# Altium project OpenMPPT2.PrjPcb
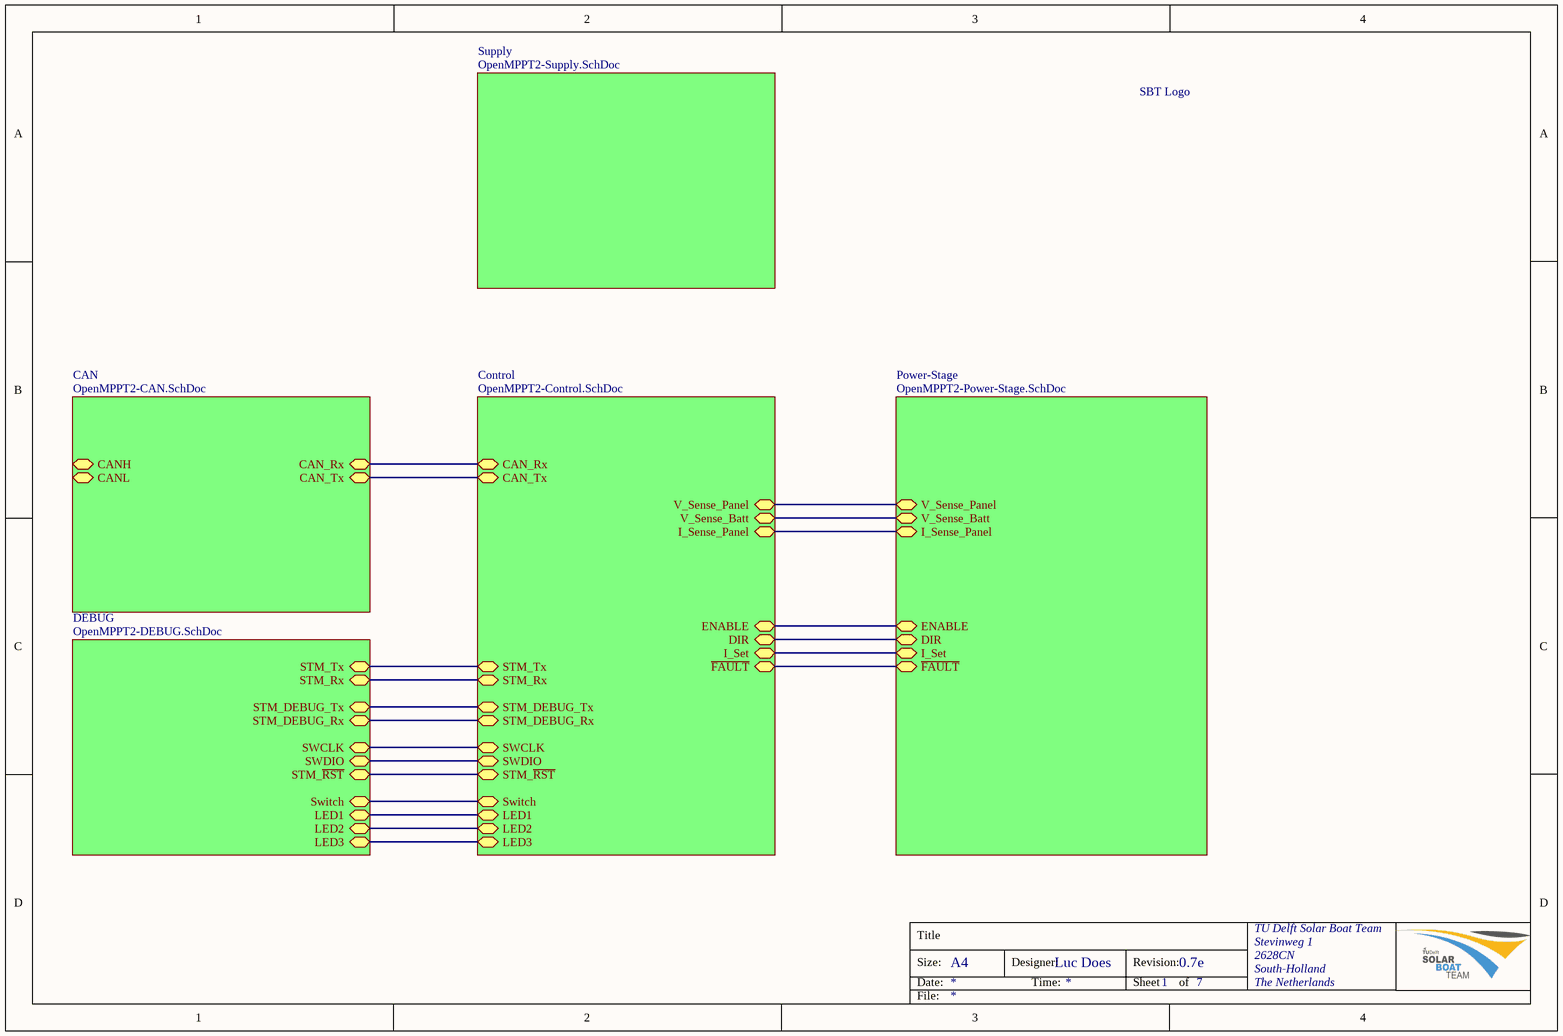
[diagram p0: Top-level.SchDoc]
adres: Stevinweg 1; Designer: Luc Does; land: The Netherlands; organisatie: TU Delft Solar Boat Team; postcode: 2628CN; Project: OpenMPPT; provincie: South-Holland; revisie: 0.7e; sheetTotaal: 7
6 sheets, 110 parts. Net scope: hierarchical (ports join the sheet entries above them; power ports are global).
Board file: OpenMPPT2.PcbDoc
Sheets:
  Top-level.SchDoc
    Control = OpenMPPT2-Control.SchDoc
    Supply = OpenMPPT2-Supply.SchDoc
    Power-Stage = OpenMPPT2-Power-Stage.SchDoc
    DEBUG = OpenMPPT2-DEBUG.SchDoc
    CAN = OpenMPPT2-CAN.SchDoc

## Sheet Top-level.SchDoc: =Project + Document
size A4; SheetNumber: 1; SheetTotal: SheetTotaal; Document: Top-level

### Parts
Logo1  SBT Logo  [SBT Logo 1000x]  (value not drawn)

### Sub-sheets
CAN = OpenMPPT2-CAN.SchDoc: CAN_Rx, CAN_Tx, CANH, CANL
Control = OpenMPPT2-Control.SchDoc: STM_~{RST}, SWCLK, SWDIO, STM_Rx, STM_Tx, STM_DEBUG_Rx, STM_DEBUG_Tx, CAN_Rx, CAN_Tx, LED1, LED2, Switch, V_Sense_Panel, I_Set, V_Sense_Batt, I_Sense_Panel, ENABLE, DIR, ~{FAULT}, LED3
DEBUG = OpenMPPT2-DEBUG.SchDoc: STM_~{RST}, SWCLK, SWDIO, STM_Rx, STM_Tx, STM_DEBUG_Tx, STM_DEBUG_Rx, LED1, LED2, Switch, LED3
Power-Stage = OpenMPPT2-Power-Stage.SchDoc: V_Sense_Panel, I_Set, V_Sense_Batt, I_Sense_Panel, ENABLE, DIR, ~{FAULT}
Supply = OpenMPPT2-Supply.SchDoc: no entries

### Nets
DEBUG_Rx: sheet Control/STM_DEBUG_Rx, sheet DEBUG/STM_DEBUG_Rx
DEBUG_Tx: sheet Control/STM_DEBUG_Tx, sheet DEBUG/STM_DEBUG_Tx
DIR: sheet Control/DIR, sheet Power-Stage/DIR
ENABLE: sheet Control/ENABLE, sheet Power-Stage/ENABLE
~{FAULT}: sheet Control/~{FAULT}, sheet Power-Stage/~{FAULT}
I_Sense_Panel: sheet Control/I_Sense_Panel, sheet Power-Stage/I_Sense_Panel
STM_~{RST}: sheet Control/STM_~{RST}, sheet DEBUG/STM_~{RST}
SWCLK: sheet Control/SWCLK, sheet DEBUG/SWCLK
SWDIO: sheet Control/SWDIO, sheet DEBUG/SWDIO
V_Sense_Batt: sheet Control/V_Sense_Batt, sheet Power-Stage/V_Sense_Batt
V_Sense_Panel: sheet Control/V_Sense_Panel, sheet Power-Stage/V_Sense_Panel
NetC503_2: sheet Control/Switch, sheet DEBUG/Switch
NetIC300_2: sheet Control/CAN_Rx, sheet CAN/CAN_Rx
NetIC300_3: sheet Control/CAN_Tx, sheet CAN/CAN_Tx
NetIC500_2: sheet Control/STM_Rx, sheet DEBUG/STM_Rx
NetIC500_3: sheet Control/STM_Tx, sheet DEBUG/STM_Tx
NetR402_1: sheet Control/I_Set, sheet Power-Stage/I_Set
NetR501_1: sheet Control/LED1, sheet DEBUG/LED1
NetR502_1: sheet Control/LED2, sheet DEBUG/LED2
NetR503_1: sheet Control/LED3, sheet DEBUG/LED3

### Notes on the sheet
- Title
- Size:
- Date:
- A4
- Designer:
- Time:
- Revision:
- Sheet
- of
- File:

### Library data of the parts
Logo1 = SBT Logo: B'vo

## Sheet OpenMPPT2-Control.SchDoc: =Project + Document
size A4; SheetNumber: 3; SheetTotal: SheetTotaal; Document: Control
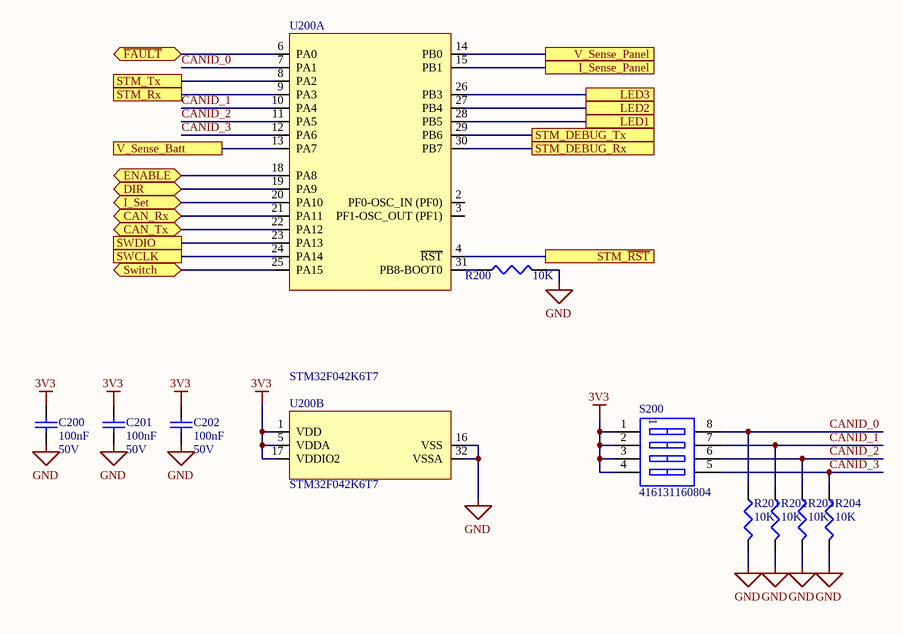
[diagram p1: OpenMPPT2-Control.SchDoc]

### Parts
C200  100nF  Voltage Rating: 50V  [C0603]
C201  100nF  Voltage Rating: 50V  [C0603]
C202  100nF  Voltage Rating: 50V  [C0603]
R200  10K  [0603]
R201  10K  [0603]
R202  10K  [0603]
R203  10K  [0603]
R204  10K  [0603]
S200  416131160804  [416131160804]
U200  STM32F042K6T7  [LQFP32]  (parts A,B of 2)

### Ports
CAN_Rx, CAN_Tx, DIR, ENABLE, I_Sense_Panel, I_Set, LED1, LED2, LED3, STM_DEBUG_Rx, STM_DEBUG_Tx, STM_Rx, STM_Tx, STM_~{RST}, SWCLK, SWDIO, Switch, V_Sense_Batt, V_Sense_Panel, ~{FAULT}

### Nets
3V3: C200.2 C201.2 C202.2 S200.1 S200.2 S200.3 S200.4 U200.1(VDD) U200.5(VDDA) U200.17(VDDIO2)
GND: C200.1 C201.1 C202.1 R200.2 R201.2 R202.2 R203.2 R204.2 U200.16(VSS) U200.32(VSSA)
CANID_0: R201.1 S200.8 U200.7(PA1)
CANID_1: R202.1 S200.7 U200.10(PA4)
CANID_2: R203.1 S200.6 U200.11(PA5)
CANID_3: R204.1 S200.5 U200.12(PA6)
DEBUG_Rx: U200.30(PB7) ; port STM_DEBUG_Rx
DEBUG_Tx: U200.29(PB6) ; port STM_DEBUG_Tx
DIR: U200.19(PA9) ; port DIR
ENABLE: U200.18(PA8) ; port ENABLE
~{FAULT}: U200.6(PA0) ; port ~{FAULT}
I_Sense_Panel: U200.15(PB1) ; port I_Sense_Panel
STM_~{RST}: U200.4(~{RST}) ; port STM_~{RST}
SWCLK: U200.24(PA14) ; port SWCLK
SWDIO: U200.23(PA13) ; port SWDIO
V_Sense_Batt: U200.13(PA7) ; port V_Sense_Batt
V_Sense_Panel: U200.14(PB0) ; port V_Sense_Panel
NetC503_2: U200.25(PA15) ; port Switch
NetIC300_2: U200.21(PA11) ; port CAN_Rx
NetIC300_3: U200.22(PA12) ; port CAN_Tx
NetIC500_2: U200.9(PA3) ; port STM_Rx
NetIC500_3: U200.8(PA2) ; port STM_Tx
NetR200_1: R200.1 U200.31(PB8-BOOT0)
NetR402_1: U200.20(PA10) ; port I_Set
NetR501_1: U200.28(PB5) ; port LED1
NetR502_1: U200.27(PB4) ; port LED2
NetR503_1: U200.26(PB3) ; port LED3

Not connected (* = marked no-connect by the designer): U200 2(PF0-OSC_IN_(PF0)) 3(PF1-OSC_OUT_(PF1))

### Notes on the sheet
- Title
- Size:
- Date:
- A4
- Designer:
- Time:
- Revision:
- Sheet
- of
- File:

### Library data of the parts
C200-C202 = 100nF/0603/CER/50V: Capacitor, 100nF, 50V, X7R; Capacitance Tolerance: ± 10%; Capacitor Case Style: 0603; Brand Number: MCCA000255; Brand: MULTICOMP; Dielectric Characteristic: X7R; Capacitance: 100nF; Temperature Range: -55°C to +125°C; Price: 0,008; Order Code Supplier: 1759122RL; Supplier: Farnell
R200-R204 = 10K/0603/0063W/50V: Resistor, 10K, 1%, 0.063W, 50V, 100PPM, 0603; Brand: MULTICOMP; Brand Number: MC0063W0603110K; Case Style: 0603; Order Code Supplier: 1469748; Power Rating: 0.063W; Price: 0,038; Resistance: 10K; Supplier: Farnell; Temperature Coefficient: ± 100PPM; Temperature Range: -55°C to +125°C; Voltage Rating: 50V
S200 = 416131160804: 1.27 mm small compact SMD flat actuator with top tape WS-DISV; Pole Number: 4; ComponentLink1Description: Manufacturer; ComponentLink1URL: http://www.we-online.de; ComponentLink2Description: Datasheet; ComponentLink2URL: http://katalog.we-online.de/em/datasheet/4161311608xx.pdf; Part Number: 416131160804; Published Date: March 2017; Publisher: Wurth Elektronik
U200 = STM32F042K6T7: 32 Bit Microcontroller, USB Line, ARM Cortex-M0, 48 MHz, 128 KB, 16 KB, 48, LQFP; Brand: STMICROELECTRONICS; Order Code Supplier: 2469553; Supplier: Farnell; Brand Number: STM32F042K6T7; Price: 1.46

## Sheet OpenMPPT2-Supply.SchDoc: =Project + Document
size A4; SheetNumber: 2; SheetTotal: 7; Document: Supply
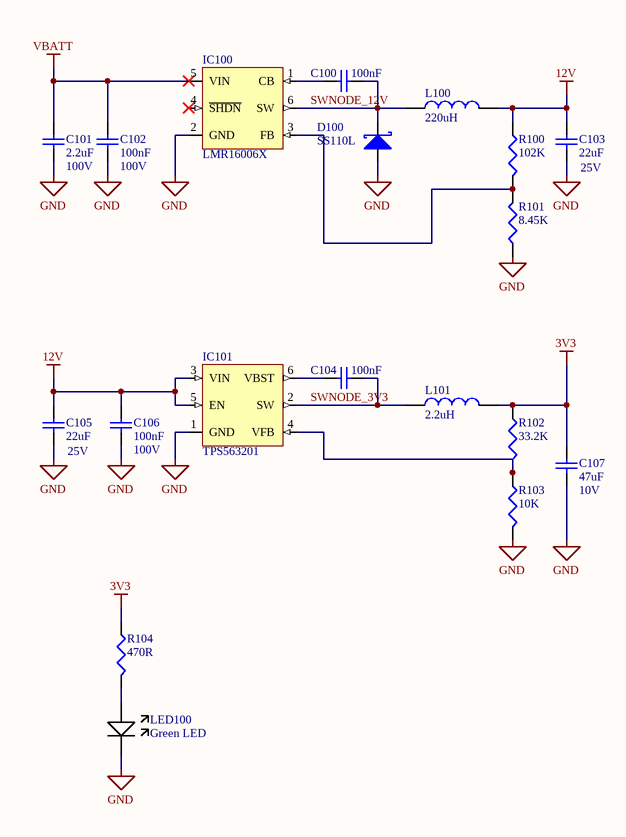
[diagram p2: OpenMPPT2-Supply.SchDoc]

### Parts
C100  100nF  [C-0805]
C101  2.2uF  Voltage Rating: 100V  [C-1210]
C102  100nF  Voltage Rating: 100V  [C-0805]
C103  22uF  Voltage Range: 25V  [C-1206]
C104  100nF  [C-0805]
C105  22uF  Voltage Range: 25V  [C-1206]
C106  100nF  Voltage Rating: 100V  [C-0805]
C107  47uF  Voltage Rating: 10V  [C-1210]
D100  SS110L  [SUB-SMA]
IC100  LMR16006X  [SOT-23-6]
IC101  TPS563201  [SOT-23-6]
L100  value 220uH  [WE-PD_1050_Metal Base]  (hidden comment: WE-PD, 7447714221)
L101  value 2.2uH  [WE-PD_7332_Metal Base]  (hidden comment: WE-PD, 744778002)
LED100  Green LED  [0603]
R100  102K  [0603]
R101  8.45K  [0603]
R102  33.2K  [0603]
R103  10K  [0603]
R104  470R  [0603]

### Nets
3V3: C107.1 L101.2 R102.1 R104.1
12V: C103.1 C105.1 C106.2 IC101.3(VIN) IC101.5(EN) L100.2 R100.1
GND: C101.1 C102.1 C103.2 C105.2 C106.1 C107.2 D100.1(A) IC100.2(GND) IC101.1(GND) LED100.K R101.1 R103.2
VBATT: C101.2 C102.2 IC100.5(VIN)
SWNODE_3V3: C104.2 IC101.2(SW) L101.1
SWNODE_12V: C100.2 D100.2(K) IC100.6(SW) L100.1
NetC100_1: C100.1 IC100.1(CB)
NetC104_1: C104.1 IC101.6(VBST)
NetIC100_3: IC100.3(FB) R100.2 R101.2
NetIC101_4: IC101.4(VFB) R102.2 R103.1
NetLED100_A: LED100.A R104.2

Not connected (* = marked no-connect by the designer): IC100 4(~{SHDN})*

### Notes on the sheet
- Title
- Size:
- Date:
- A4
- Designer:
- Time:
- Revision:
- Sheet
- of
- File:

### Library data of the parts
C100 C102 C104 C106 = 100nF/0805/CER/100V: Capacitor, 100nF, 100V, X7R; Capacitance Tolerance: ± 10%; Capacitor Case Style: 0805; Brand Number: C0805C104K1RACTU; Brand: KEMET; Dielectric Characteristic: X7R; Capacitance: 100nF; Temperature Range: -55°C to +125°C; Price: 0,096; Order Code Supplier: 1650862; Supplier: Farnell
  C100 C104: Voltage Rating: 100V
C101 = 2.2uF/1210/CER/100V: Capacitor, 2.2uF, 100V, X7R; Capacitance Tolerance: ± 20%; Capacitor Case Style: 1210; Brand Number: C1210C225M1RACTU; Brand: KEMET; Dielectric Characteristic: X7R; Capacitance: 2.2uF; Temperature Range: -55°C to +125°C; Price: 0,64; Order Code Supplier: 1838747; Supplier: Farnell
C103 C105 = 22uF/1206/CER/25V: Capacitor, 22uF, 25V, ±10%, X5R, C1206, T:-55°C to +85°C; Brand: Murata; Brand Number: GRM31CR61E226KE15L; Capacitor Case Style: 1206; Order Code Supplier: 1797010; Price: 0,64; Dielectric Characteristic: X5R; Capacitance: 22uF; Capacitance Tolerance: ± 10%; Supplier: Farnell; Temperature Range: -55°C to +85°C
C107 = 47uF/1210/CER/10V: Capacitor, 47uF, 10V, X7R; Capacitance Tolerance: ± 10%; Capacitor Case Style: 1210; Brand Number: GRM32ER71A476KE15L; Brand: MURATA; Dielectric Characteristic: X7R; Capacitance: 47uF; Temperature Range: -55°C to +125°C; Price: 1,85; Order Code Supplier: 1797018; Supplier: Farnell
D100 = SS110L: Diode Schottky, Vrrm: 100V, If: 1A, Vf: 0.9V; Brand: TAIWAN SEMICONDUCTOR; Case Style: SMF; Brand Number: SS110L; Forward Current: 1A; Forward Voltage: 0.9V; Order Code Supplier: 1559156; Price: 0,191; Supplier: Farnell; Temperature Range: -55°C to +150°C; Vrrm: 100V
IC100 = LMR16006X: 60V, 600mA Step-Down Regulator; Brand: Texas Instruments; Case Style: TSOT-6; Brand Number: LMR16006X; Order Code Supplier: 2455133; Price: 3,37; Supplier: Farnell; Temperature Range: -55°C to +155°C
IC101 = TPS563201: 17V Input, 3-A Synchronous Step-Down Voltage Regulator; Brand: Texas Instruments; Case Style: TSOT; Brand Number: TPS563201; Order Code Supplier: 2522588; Price: 1,44; Supplier: Farnell; Temperature Range: -55°C to +155°C
L100 = WE-PD, 7447714221: WE-PD SMD Shielded Power Inductor, size 1050, 220uH; Base: Metal Base; PublishedDate: Sep. 2016; Publisher: Wurth Elektronik; ComponentLink1Description: Manufacturer; ComponentLink1URL: http://www.we-online.de; ComponentLink2Description: Datasheet; ComponentLink2URL: http://katalog.we-online.com/pbs/datasheet/7447714221.pdf; PartNumber: 7447714221; Size: 1050
L101 = WE-PD, 744778002: WE-PD SMD Shielded Power Inductor, size 7332, 2.2uH; Base: Metal Base; PublishedDate: Sep. 2016; Publisher: Wurth Elektronik; ComponentLink1Description: Manufacturer; ComponentLink1URL: http://www.we-online.de; ComponentLink2Description: Datasheet; ComponentLink2URL: http://katalog.we-online.com/pbs/datasheet/744778002.pdf; PartNumber: 744778002; Size: 7332
LED100 = KPT-1608SGC: LED, Green, 0603; Brand: Kingbright; Forward Voltage: 2.2V; Forward Current: 20mA; Order Code Supplier: 2099223; Supplier: Farnell; Price: 0,057; Brand Number: KPT-1608SGC
R100 = 102K/0603/0100W/75V: Resistor, 102K, 1%, 0.063W, 50V, 100PPM, 0603; Brand: Vishay; Brand Number: CRCW0603102KFKEA.; Power Rating: 0.100W; Voltage Rating: 75V; Case Style: 0603; Order Code Supplier: 2138497; Price: 0,0402; Resistance: 102K; Supplier: Farnell; Temperature Coefficient: ± 100PPM; Temperature Range: -55°C to +125°C
R101 = 8.45K/0603/0100W/75V: Resistor, 8.45K, 1%, 0.1W, 75V, 100PPM, 0603; Brand: Vishay; Brand Number: CRCW06038K45FKEA.; Case Style: 0603; Order Code Supplier: 2138418; Power Rating: 0.1W; Price: 0,0419; Resistance: 8.45K; Supplier: Farnell; Temperature Coefficient: ± 100PPM; Temperature Range: -55°C to +155°C; Voltage Rating: 75V
R102 = 33.2K/0603/0063W/50V: Resistor, 33.2K, 1%, 0.063W, 50V, 100PPM, 0603; Brand: MULTICOMP; Brand Number: MC 0.063W 0603 1% 33K2; Case Style: 0603; Order Code Supplier: 1170939; Power Rating: 0.063W; Price: 0,038; Resistance: 33.2K; Supplier: Farnell; Temperature Coefficient: ± 100PPM; Temperature Range: -55°C to +125°C; Voltage Rating: 50V
R103 = 10K/0603/0063W/50V: as R200 on sheet OpenMPPT2-Control; Case Style: 0603; Order Code Supplier: 2130939; Power Rating: 0.063W; Price: 0,038; Resistance: 10K; Supplier: Farnell; Temperature Coefficient: ± 100PPM; Temperature Range: -55°C to +125°C; Voltage Rating: 50V
R104 = 470/0603/0125W/50V: Resistor, 470R, 1%, 0.125W, 50V, 100PPM, 0603; Brand: MULTICOMP; Brand Number: MCHP03W8F4700T5E; Case Style: 0603; Order Code Supplier: 1576273; Power Rating: 0.125W; Price: 0,08; Resistance: 470R; Supplier: Farnell; Temperature Coefficient: ± 100PPM; Temperature Range: -55°C to +155°C; Voltage Rating: 50V

## Sheet OpenMPPT2-Power-Stage.SchDoc: =Project + Document
size A4; SheetNumber: 5; SheetTotal: SheetTotaal; Document: Power-Stage
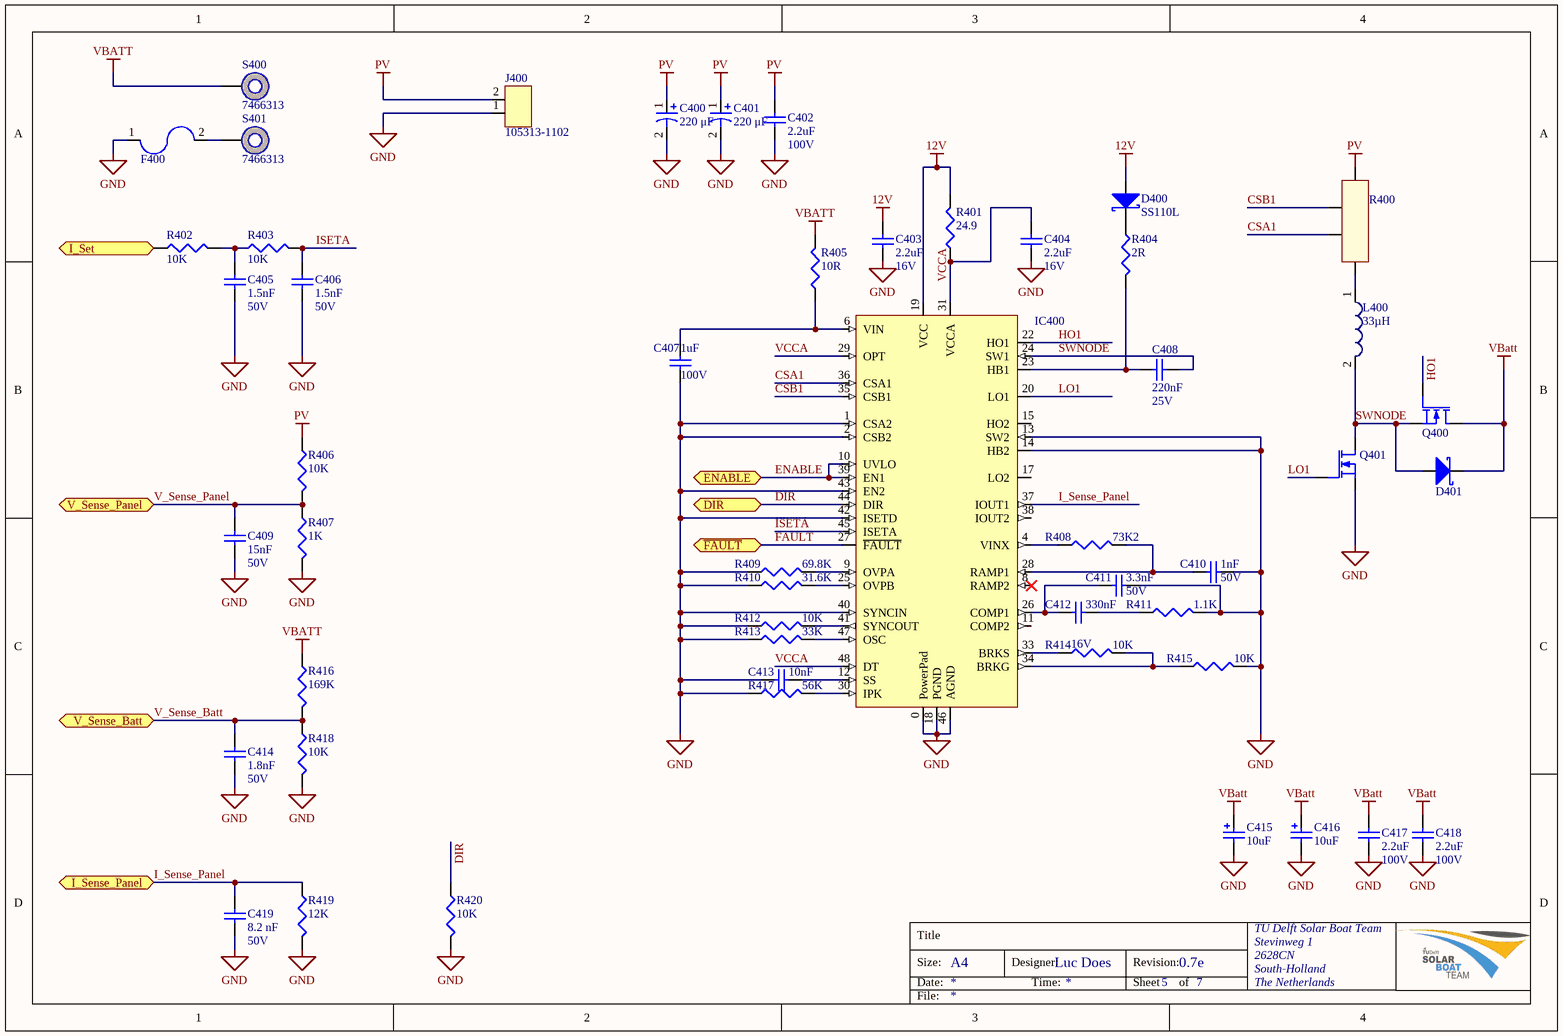
[diagram p3: OpenMPPT2-Power-Stage.SchDoc]

### Parts
C400  220 μF  [WCAP-ATLI 10x16x5x0.6]
C401  220 μF  [WCAP-ATLI 10x16x5x0.6]
C402  2.2uF  Voltage Rating: 100V  [C-1812]
C403  2.2uF  Voltage Rating: 16V  [C-1206]
C404  2.2uF  Voltage Rating: 16V  [C-1206]
C405  1.5nF  Voltage Rating: 50V  [C0603]
C406  1.5nF  Voltage Rating: 50V  [C0603]
C407  1uF  Voltage Rating: 100V  [C-1206]
C408  220nF  Voltage Rating: 25V  [C0603]
C409  15nF  Voltage Rating: 50V  [C0603]
C410  1nF  Voltage Rating: 50V  [C0603]
C411  3.3nF  Voltage Rating: 50V  [C0603]
C412  330nF  Voltage Rating: 16V  [C0603]
C413  10nF  [C0603]
C414  1.8nF  Voltage Rating: 50V  [C0603]
C415  10uF  [WCAP-PTHR_8x11.5x3.5x0.6]
C416  10uF  [WCAP-PTHR_8x11.5x3.5x0.6]
C417  2.2uF  Voltage Rating: 100V  [C-1812]
C418  2.2uF  Voltage Rating: 100V  [C-1812]
C419  8.2 nF  Voltage Rating: 50V  [C0603]
D400  SS110L  [SUB-SMA]
D401  SDT5H100P5-7  [PowerDI5]  (value not drawn)
F400  0154010.DR  [0154010.DR]  (value not drawn)
IC400  LM5170  [TQFP48 - PowerPad]  (value not drawn)
J400  105313-1102  [Nano-Fit 2p RA]
L400  33µH  [WE-HCF 2818]
Q400  PSMN010-80YL  [SOT-669]  (value not drawn)
Q401  PSMN010-80YL  [SOT-669]  (value not drawn)
R400  WSK06125L000FEA  [WSK0612]  (value not drawn)
R401  24.9  [0603]
R402  10K  [0603]
R403  10K  [0603]
R404  2R  [0603]
R405  10R  [0603]
R406  10K  [0603]
R407  1K  [0603]
R408  73K2  [0603]
R409  69.8K  [0603]
R410  31.6K  [0603]
R411  1.1K  [0603]
R412  10K  [0603]
R413  33K  [0603]
R414  10K  [0603]
R415  10K  [0603]
R416  169K  [0603]
R417  56K  [0603]
R418  10K  [0603]
R419  12K  [0603]
R420  10K  [0603]
S400  7466313  [7466313-2]
S401  7466313  [7466313-2]

### Ports
DIR, ENABLE, I_Sense_Panel, I_Set, V_Sense_Batt, V_Sense_Panel, ~{FAULT}

### Nets
12V: C403.2 D400.1(A) IC400.19(VCC) R401.2
GND: C400.2 C401.2 C402.2 C403.1 C404.1 C405.1 C406.1 C407.1 C409.2 C410.2 C411.2 C413.1 C414.2 C415.2(N) C416.2(N) C417.2 C418.2 C419.1 F400.1 IC400.0(PowerPad) IC400.1(CSA2) IC400.2(CSB2) IC400.13(SW2) IC400.14(HB2) IC400.18(PGND) IC400.40(SYNCIN) IC400.42(ISETD) IC400.43(EN2) IC400.46(AGND) J400.1 Q401.S R407.2 R409.1 R410.1 R411.2 R412.1 R413.1 R415.2 R417.1 R418.2 R419.2 R420.2
PV: C400.1 C401.1 C402.1 J400.2 R400.b R406.1
VBATT: C415.1(P) C416.1(P) C417.1 C418.1 D401.K Q400.D R405.2 R416.1 S400.1
CSA1: IC400.36(CSA1) R400.as
CSB1: IC400.35(CSB1) R400.bs
DIR: IC400.44(DIR) R420.1 ; port DIR
ENABLE: IC400.10(UVLO) IC400.39(EN1) ; port ENABLE
~{FAULT}: IC400.27(~{FAULT}) ; port ~{FAULT}
HO1: IC400.22(HO1) Q400.G
I_Sense_Panel: C419.2 IC400.37(IOUT1) R419.1 ; port I_Sense_Panel
ISETA: C406.2 IC400.45(ISETA) R403.2
LO1: IC400.20(LO1) Q401.G
SWNODE: C408.2 D401.A IC400.24(SW1) L400.2 Q400.S Q401.D
V_Sense_Batt: C414.1 R416.2 R418.1 ; port V_Sense_Batt
V_Sense_Panel: C409.1 R406.2 R407.1 ; port V_Sense_Panel
VCCA: C404.2 IC400.29(OPT) IC400.31(VCCA) IC400.48(DT) R401.1
NetC405_2: C405.2 R402.2 R403.1
NetC407_2: C407.2 IC400.6(VIN) R405.1
NetC408_1: C408.1 IC400.23(HB1) R404.2
NetC410_1: C410.1 IC400.28(RAMP1) R408.2
NetC411_1: C411.1 C412.1 IC400.26(COMP1)
NetC412_2: C412.2 R411.1
NetC413_2: C413.2 IC400.12(SS)
NetD400_2: D400.2(K) R404.1
NetF400_2: F400.2 S401.1
NetIC400_4: IC400.4(VINX) R408.1
NetIC400_9: IC400.9(OVPA) R409.2
NetIC400_25: IC400.25(OVPB) R410.2
NetIC400_30: IC400.30(IPK) R417.2
NetIC400_33: IC400.33(BRKS) R414.1
NetIC400_34: IC400.34(BRKG) R414.2 R415.1
NetIC400_41: IC400.41(SYNCOUT) R412.2
NetIC400_47: IC400.47(OSC) R413.2
NetL400_1: L400.1 R400.a
NetR402_1: R402.1 ; port I_Set

Not connected (* = marked no-connect by the designer): IC400 8(RAMP2)* 11(COMP2) 15(HO2) 17(LO2) 38(IOUT2)

### Notes on the sheet
- Title
- Size:
- Date:
- A4
- Designer:
- Time:
- Revision:
- Sheet
- of
- File:

### Library data of the parts
C400 C401 = WCAP-ATLI 10x16x5x0.6 860080675015: WCAP-ATLI Aluminum Electrolytic Capacitors , 220 μF; + / - 20%; 50 V , 10 x 16; Manufacturer: Wurth Elektronik; E-mail: libraries@we-online.com; Characteristics: Aluminum Electrolytic Capacitor;Recommended soldering: Wave;Operating temperature: –55 °C to +105 °C;Low impedance product series;Load life: 2000–5000 h @ +105 °C; ComponentLink1Description: Manufacturer; ComponentLink1URL: http://www.we-online.com; ComponentLink2Description: Datasheet; ComponentLink2URL: http://katalog.we-online.de/pbs/datasheet/860080675015.pdf; Created by: Karrer Zheng; Created Date: 5/13/2015; Capacitance: 220 μF; Application: Applied to high frequency secondary side output filter loop, general switching power supply, DC-DC converter, AC-DC converter, adapter, charger, TV, VCR, DC motor circuit filter, LCD TV digital audio, digital TV, digital camera, digital video camera, satellite receiver and etc.; partNo: 860080675015
C402 C417 C418 = 2.2uF/1812/CER/100V: Capacitor, 2.2uF, 100V, X7R; Capacitance Tolerance: ± 20%; Capacitor Case Style: 1210; Brand Number: C4532X7R2A225M230KA; Brand: TDK; Dielectric Characteristic: X7R; Capacitance: 2.2uF; Temperature Range: -55°C to +125°C; Price: 0.185; Order Code Supplier: 1843176; Supplier: Farnell
C403 C404 = 2.2uF/1206/CER/16V: Capacitor, 2.2uF, 16V, X7R; Capacitance Tolerance: ± 10%; Capacitor Case Style: 1206; Brand Number: C1206C225K4RACTU; Brand: KEMET; Dielectric Characteristic: X7R; Capacitance: 2.2uF; Temperature Range: -55°C to +125°C; Price: 0,28; Order Code Supplier: 9227911; Supplier: Farnell
C405 C406 = 1.5nF/0603/CER/50V: Capacitor, 1.5pF, 50V, C0G/NP0; Capacitance Tolerance: ± 5%; Capacitor Case Style: 0603; Brand Number: GRM1885C1H152JA01D; Brand: MURATA; Dielectric Characteristic: C0G/NP0; Capacitance: 1.5nF; Temperature Range: -55°C to +125°C; Price: 0,0551; Order Code Supplier: 8819939; Supplier: Farnell
C407 = 1uF/1206/CER/100V: Capacitor, 1uF, 100V, X7R; Capacitance Tolerance: ± 10%; Capacitor Case Style: 1206; Brand Number: 12061C105K4Z2A; Brand: AVX; Dielectric Characteristic: X7R; Capacitance: 1uF; Temperature Range: -55°C to +125°C; Price: 0,52; Order Code Supplier: 1833855; Supplier: Farnell
C408 = 220nF/0603/CER/25V: Capacitor, 220nF, 25V, X7R; Capacitance Tolerance: ± 10%; Capacitor Case Style: 0603; Brand Number: 06033C224KAT2A; Brand: AVX; Dielectric Characteristic: X7R; Capacitance: 220nF; Temperature Range: -55°C to +125°C; Price: 0,111; Order Code Supplier: 320795; Supplier: Farnell
C409 = 15nF/0603/CER/50V: Capacitor, 15nF, 50V, X7R; Capacitance Tolerance: ± 10%; Capacitor Case Style: 0603; Brand Number: 0603B153K500CT; Brand: WALSIN; Dielectric Characteristic: X7R; Capacitance: 15nF; Temperature Range: -55°C to +125°C; Price: 0,0169; Order Code Supplier: 2496840; Supplier: Farnell
C410 = 1nF/0603/CER/50V/C0G: Capacitor, 1nF, 50V, C0G; Dielectric Characteristic: C0G/NP0; Capacitance Tolerance: ± 5%; Capacitor Case Style: 0603; Brand Number: GRM1885C1H102JA01D; Brand: MURATA; Capacitance: 1nF; Temperature Range: -55°C to +125°C; Price: 0,0299; Order Code Supplier: 8819920; Supplier: Farnell
C411 = 3.3nF/0603/CER/50V: Capacitor, 3.3nF, 50V, X7R; Capacitance Tolerance: ± 10%; Capacitor Case Style: 0603; Brand Number: 0603B332K500CT; Brand: WALSIN; Dielectric Characteristic: X7R; Capacitance: 3.3nF; Temperature Range: -55°C to +125°C; Price: 0,0118; Order Code Supplier: 2496853; Supplier: Farnell
C412 = 330nF/0603/CER/16V: Capacitor, 330nF, 16V, X7R; Capacitance Tolerance: ± 10%; Capacitor Case Style: 0603; Brand Number: GRM188R71C334KA01D; Brand: MURATA; Dielectric Characteristic: X7R; Capacitance: 330nF; Temperature Range: -55°C to +125°C; Price: 0,052; Order Code Supplier: 1828892; Supplier: Farnell
C413 = 10nF/0603/CER/50V: Capacitor, 10nF, 50V, X7R; Capacitance Tolerance: ± 10%; Capacitor Case Style: 0603; Brand Number: C0603C103K5RACTU; Brand: KEMET; Dielectric Characteristic: X7R; Capacitance: 10nF; Temperature Range: -55°C to +125°C; Price: 0,011; Order Code Supplier: 1414609; Supplier: Farnell
C414 = 1.8nF/0603/CER/50V: Capacitor, 1.8nF, 50V, X7R; Capacitance Tolerance: ± 10%; Capacitor Case Style: 0603; Brand Number: 0603B182K500CT; Brand: WALSIN; Dielectric Characteristic: X7R; Capacitance: 1.8nF; Temperature Range: -55°C to +125°C; Price: 0,015; Order Code Supplier: 2524826; Supplier: Farnell
C415 C416 = WCAP-PTHR, 870055874001: WCAP-PTHR Aluminum Polymer Capacitors, 10uF; RatedVoltage: 63V; PublishedDate: July 2016; Publisher: Wurth Elektronik; ComponentLink1Description: Manufacturer; ComponentLink1URL: http://www.we-online.de; ComponentLink2Description: Datasheet; ComponentLink2URL: http://katalog.we-online.com/pbs/datasheet/870055874001.pdf; PartNumber: 870055874001; Value: 10uF; Size: 8mmx11.5mm
C419 = 8.2nF/0603/CER/50V: Capacitor, 8.2nF, 50V, X7R; Capacitance Tolerance: ± 10%; Capacitor Case Style: 0603; Brand Number: VJ0603Y822KCAAJ; Brand: VISHAY; Dielectric Characteristic: X7R; Capacitance: 8.2 nF; Temperature Range: -55°C to +125°C; Price: 0,163; Order Code Supplier: 2672789; Supplier: Farnell
D400 = SS110L: as D100 on sheet OpenMPPT2-Supply; Brand Number: SS110L; Forward Current: 1A; Forward Voltage: 0.9V; Order Code Supplier: 1559156; Price: 0,191; Supplier: Farnell; Temperature Range: -55°C to +150°C; Vrrm: 100V
D401 = SDT5H100P5-7: Diode Schottky, Vrrm: 100V, If: 5.0A, Vf: 0.62V; Brand: Diodes Incorporated; Brand Number: SDT5H100P5-7; Case Style: PowerDI5; Forward Current: 5.0A; Forward Voltage: 0.62V; Order Code Supplier: 2709573; Price: 0,633; Supplier: Farnell; Temperature Range: -55°C to +150°C; Vrrm: 100V
F400 = 0154010.DR: Miniature SMD Fuse and Holder Assembly, 10A; Supplier: Farnell; Price: 1,53; Order Code Supplier: 2688684; Brand Number: 0154010.DR
IC400 = LM5170: Multiphase Bidirectional Current Controller; Brand: Texas Instruments; Case Style: TQFP-48; Brand Number: LM5170; Supplier: Digi-Key; Order Code Supplier: 296-45255-1-ND; Price: 11,00
J400 = 105313-1102: Molex nano-fit 2 pins connector, single row, right angle; Case Style: 105313; Pitch: 2.5mm; Brand: MOLEX; Brand Number: 105313-1102; Order Code Supplier: 538-105313-1102; Price: 0,672; Supplier: Mouser
L400 = WE-HCF 2818, 7443643300: SMD High Current Inductor WE-HCF, L=33µH; PartNo: 7443643300; Inductance: 33µH; ComponentLink1Description: Manufacturer; ComponentLink1URL: http://www.we-online.de; Created by: Christin Zierenner; Created Date: Oct-2014; ComponentLink2Description: Datasheet; ComponentLink2URL: http://katalog.we-online.de/kataloge/eisos/media/pdf/7443643300.pdf; Supplier: Farnell; Order Code Supplier: 2431617
Q400 Q401 = PSMN010-80YL: Mosfet, N-channel, 80V, 84A, 1.7V, 8.1mohm; Brand: NXP; Gate Source Voltage: 10V; On Resistance: 0.0081ohm; Transistor Polarity: N Channel; Brand Number: PSMN010-80YL; Case Style: SOT-669; Drain Current: 84A; Drain Source Voltage: 80V; Order Code Supplier: 2617065; Price: 0,932; Supplier: Farnell; Temperature Range: -55°C to +150°C; Threshold Voltage: 1.7V
R400 = WSK06125L000FEA: RES, METAL STRIP, 0.005OHM, 1%; Case Style: 0612; Brand: VISHAY; Supplier: Farnell; Price: 0.899; Order Code Supplier: 2420730; Brand Number: WSK06125L000FEA
R401 = 24.9/0603/0100W/75V: Resistor, 24.9R, 1%, 0.1W, 75V, 100PPM, 0603; Brand: VISHAY; Brand Number: CRCW060324R9FKEA.; Case Style: 0603; Order Code Supplier: 2141207; Power Rating: 0.1W; Price: 0,0419; Resistance: 24.9; Supplier: Farnell; Temperature Coefficient: ± 100PPM; Temperature Range: -55°C to +155°C; Voltage Rating: 75V
R402 R403 R406 R412 R414 R415 R418 R420 = 10K/0603/0063W/50V: as R200 on sheet OpenMPPT2-Control; Case Style: 0603; Power Rating: 0.063W; Price: 0,038; Resistance: 10K; Supplier: Farnell; Temperature Coefficient: ± 100PPM; Temperature Range: -55°C to +125°C; Voltage Rating: 50V
  R402 R403 R412 R414 R415: Order Code Supplier: 1469748
  R406 R418 R420: Order Code Supplier: 2130939
R404 = 2/0603/0100W/75V: Resistor, 2R, 5%, 0.1W, 75V, 200PPM, 0603; Brand: PANASONIC; Brand Number: ERJ3GEYJ2R0V; Case Style: 0603; Order Code Supplier: 2059531; Power Rating: 0.1W; Price: 0,009; Resistance: 2R; Supplier: Farnell; Temperature Coefficient: ± 200PPM; Temperature Range: -55°C to +125°C; Voltage Rating: 75V
R405 = 10/0603/0125W/50V: Resistor, 10R, 1%, 0.125W, 50V, 200PPM, 0603; Brand: MULTICOMP; Brand Number: MCHP03W8F100JT5E; Case Style: 0603; Order Code Supplier: 1576250; Power Rating: 0.125W; Price: 0,08; Resistance: 10R; Supplier: Farnell; Temperature Coefficient: ± 200PPM; Temperature Range: -55°C to +155°C; Voltage Rating: 50V
R407 = 1K/0603/0063W/50V: Resistor, 1K, 1%, 0.063W, 50V, 100PPM, 0603; Brand: MULTICOMP; Brand Number: MC0063W060311K; Case Style: 0603; Order Code Supplier: 2130855; Power Rating: 0.063W; Price: 0,039; Resistance: 1K; Supplier: Farnell; Temperature Coefficient: ± 100PPM; Temperature Range: -55°C to +125°C; Voltage Rating: 50V
R408 = 73K2/0603/0063W/50V: Resistor, 73K2, 1%, 0.063W, 50V, 100PPM, 0603; Brand: MULTICOMP; Brand Number: CRCW060373K2FKEA; Case Style: 0603; Order Code Supplier: 2138484; Power Rating: 0.063W; Price: 0,0185; Resistance: 73K2; Supplier: Farnell; Temperature Coefficient: ± 100PPM; Temperature Range: -55°C to +125°C; Voltage Rating: 50V
R409 = 69.8K/0603/0100W/100V: Resistor, 69.8K, 0.1%, 0.1W, 100V, 15PPM, 0603; Brand: TE CONNECTIVITY / HOLSWORTHY; Brand Number: RP73D1J69K8BTDG; Temperature Coefficient: ± 100PPM; Case Style: 0603; Order Code Supplier: 1752678; Power Rating: 0.1W; Price: 1,07; Resistance: 69.8K; Supplier: Farnell; Temperature Range: -55°C to +155°C; Voltage Rating: 100V
R410 = 31.6K/0603/0100W/75V: Resistor, 31.6K, 1%, 0.1W, 75V, 100PPM, 0603; Brand: Vishay; Brand Number: CRCW060331K6FKEA.; Case Style: 0603; Order Code Supplier: 2138454; Power Rating: 0.1W; Price: 0,0419; Resistance: 31.6K; Supplier: Farnell; Temperature Coefficient: ± 100PPM; Temperature Range: -55°C to +155°C; Voltage Rating: 75V
R411 = 1.1K/0603/0100W/75V: Resistor, 1.1K, 1%, 0.1W, 75V, 100PPM, 0603; Brand: Vishay; Brand Number: CRCW06031K10FKEA.; Case Style: 0603; Order Code Supplier: 2138353; Power Rating: 0.1W; Price: 0,00419; Resistance: 1.1K; Supplier: Farnell; Temperature Coefficient: ± 100PPM; Temperature Range: -55°C to +155°C; Voltage Rating: 75V
R413 = 33K/0603/0063W/50V: Resistor, 33K, 1%, 0.063W, 50V, 100PPM, 0603; Brand: MULTICOMP; Brand Number: MC 0.063W 0603 1% 33K; Case Style: 0603; Order Code Supplier: 9331034; Power Rating: 0.063W; Price: 0,038; Resistance: 33K; Supplier: Farnell; Temperature Coefficient: ± 100PPM; Temperature Range: -55°C to +125°C; Voltage Rating: 50V
R416 = 169K/0603/0063W/50V: Resistor, 169K, 1%, 0.063W, 50V, 100PPM, 0603; Brand: MULTICOMP; Brand Number: MC 0.063W 0603 1% 169K; Case Style: 0603; Order Code Supplier: 1171007; Power Rating: 0.063W; Price: 0,017; Resistance: 169K; Supplier: Farnell; Temperature Coefficient: ± 100PPM; Temperature Range: -55°C to +125°C; Voltage Rating: 50V
R417 = 56K/0603/0100W/75V: Resistor, 56K, 1%, 0.1W, 75V, 100PPM, 0603; Brand: MULTICOMP; Brand Number: MCSR06X5602FTL; Case Style: 0603; Order Code Supplier: 2138473; Power Rating: 0.1W; Price: 0,0103; Resistance: 56K; Supplier: Farnell; Temperature Coefficient: ± 100PPM; Temperature Range: -55°C to +155°C; Voltage Rating: 75V
R419 = 12K/0603/0063W/50V: Resistor, 12K, 1%, 0.063W, 50V, 100PPM, 0603; Brand: MULTICOMP; Brand Number: MC0063W0603112K; Case Style: 0603; Order Code Supplier: 2130943; Power Rating: 0.063W; Price: 0,0006; Resistance: 12K; Supplier: Farnell; Temperature Coefficient: ± 1%; Temperature Range: -55°C to +125°C; Voltage Rating: 50V
S400 S401 = 7466313: WP-SMRA SMT Right Angle M3 Thread; PublishedDate: Aug 2016; Publisher: Wurth Elektronik; ComponentLink1Description: Manufacturer; ComponentLink1URL: http://www.we-online.de; ComponentLink2Description: Datasheet; PartNumber: 7466313

## Sheet OpenMPPT2-DEBUG.SchDoc: =Project + Document
size A4; SheetNumber: 7; SheetTotal: SheetTotaal; Document: DEBUG
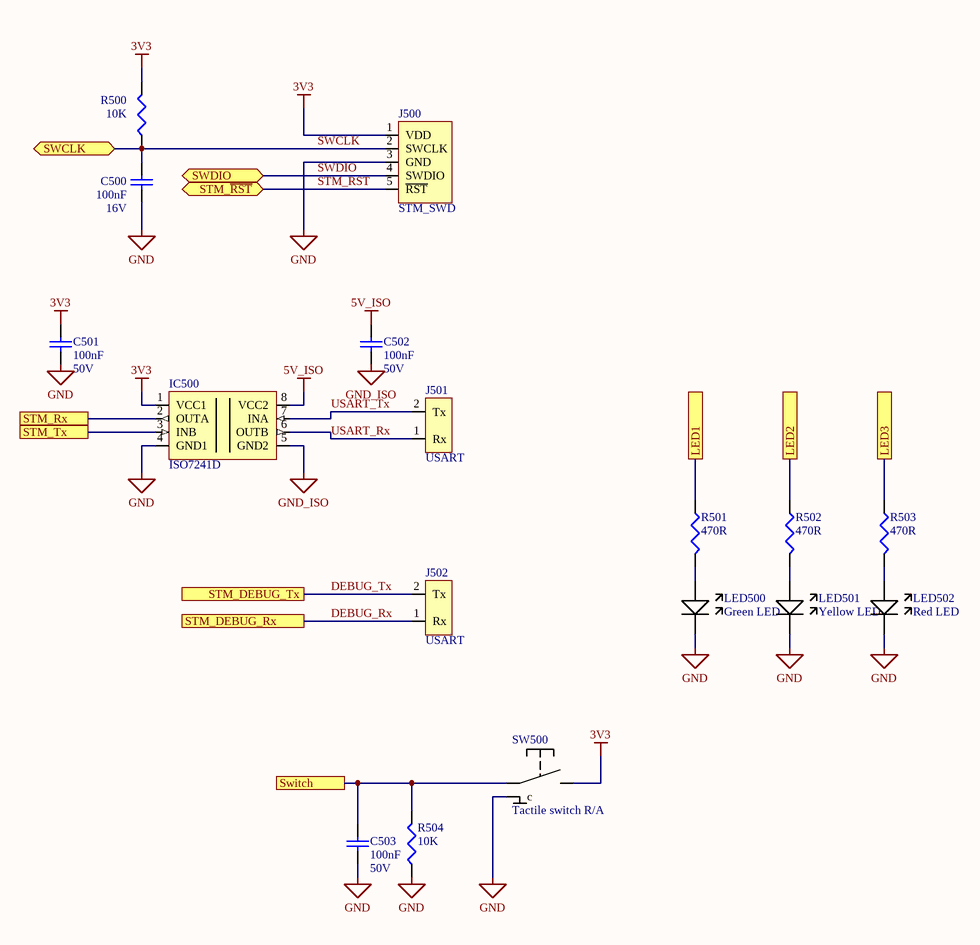
[diagram p4: OpenMPPT2-DEBUG.SchDoc]

### Parts
C500  100nF  Voltage Rating: 16V  [C0603]
C501  100nF  Voltage Rating: 50V  [C0603]
C502  100nF  Voltage Rating: 50V  [C0603]
C503  100nF  Voltage Rating: 50V  [C0603]
IC500  ISO7241D  [SO-8]
J500  STM_SWD  [Header 2.54 5p]
J501  USART  [HEADER 2.54mm 2pin]
J502  USART  [HEADER 2.54mm 2pin]
LED500  Green LED  [0603]
LED501  Yellow LED  [0603]
LED502  Red LED  [0603]
R500  10K  [0603]
R501  470R  [0603]
R502  470R  [0603]
R503  470R  [0603]
R504  10K  [0603]
SW500  Tactile switch R/A  [TactSW RA]

### Ports
LED1, LED2, LED3, STM_DEBUG_Rx, STM_DEBUG_Tx, STM_Rx, STM_Tx, STM_~{RST}, SWCLK, SWDIO, Switch

### Nets
3V3: C501.2 IC500.1(VCC1) J500.1(VDD) R500.2 SW500.2
5V_ISO: C502.2 IC500.8(VCC2)
GND: C500.2 C501.1 C503.1 IC500.4(GND1) J500.3(GND) LED500.K LED501.K LED502.K R504.1 SW500.0(c)
GND_ISO: C502.1 IC500.5(GND2)
DEBUG_Rx: J502.1(Rx) ; port STM_DEBUG_Rx
DEBUG_Tx: J502.2(Tx) ; port STM_DEBUG_Tx
STM_~{RST}: J500.5(~{RST}) ; port STM_~{RST}
SWCLK: C500.1 J500.2(SWCLK) R500.1 ; port SWCLK
SWDIO: J500.4(SWDIO) ; port SWDIO
USART_Rx: IC500.6(OUTB) J501.1(Rx)
USART_Tx: IC500.7(INA) J501.2(Tx)
NetC503_2: C503.2 R504.2 SW500.1 ; port Switch
NetIC500_2: IC500.2(OUTA) ; port STM_Rx
NetIC500_3: IC500.3(INB) ; port STM_Tx
NetLED500_A: LED500.A R501.2
NetLED501_A: LED501.A R502.2
NetLED502_A: LED502.A R503.2
NetR501_1: R501.1 ; port LED1
NetR502_1: R502.1 ; port LED2
NetR503_1: R503.1 ; port LED3

### Notes on the sheet
- Title
- Size:
- Date:
- A4
- Designer:
- Time:
- Revision:
- Sheet
- of
- File:

### Library data of the parts
C500 = 100nF/0603/CER/16V: Capacitor, 100nF, 16V, X7R; Capacitance Tolerance: ± 10%; Capacitor Case Style: 0603; Brand Number: MC0603B104K160CT; Brand: MULTICOMP; Dielectric Characteristic: X7R; Capacitance: 100nF; Temperature Range: -55°C to +125°C; Price: 0,01; Order Code Supplier: 1759016; Supplier: Farnell
C501-C503 = 100nF/0603/CER/50V: as C200 on sheet OpenMPPT2-Control; Dielectric Characteristic: X7R; Capacitance: 100nF; Temperature Range: -55°C to +125°C; Price: 0,008; Order Code Supplier: 1759122RL; Supplier: Farnell
IC500 = ISO7241D: 1/1, 1Mbps Digital Isolator; Brand: Texas Instruments; Brand Number: ISO7241D; Case Style: SO-8; Order Code Supplier: 813-6582; Price: 2,392; Supplier: RS; Temperature Range: -40°C to +85°C
J500 = STM_SWD: SWD connector compliant with STM32 Nucleo boards
LED500 = KPT-1608SGC: as LED100 on sheet OpenMPPT2-Supply; Order Code Supplier: 2099223; Supplier: Farnell; Price: 0,057; Brand Number: KPT-1608SGC
LED501 = KPT-2012YC: LED, Yellow, 0603; Brand: Kingbright; Forward Voltage: 2.1V; Forward Current: 20mA; Order Code Supplier: 2099243; Supplier: Farnell; Price: 0,045; Brand Number: KPT-2012YC
LED502 = KPT-2012EC: LED, Red, 0603; Brand: Kingbright; Forward Voltage: 2V; Forward Current: 20mA; Order Code Supplier: 2099236; Supplier: Farnell; Price: 0,052; Brand Number: KPT-2012EC
R500 R504 = 10K/0603/0063W/50V: as R200 on sheet OpenMPPT2-Control; Case Style: 0603; Power Rating: 0.063W; Price: 0,038; Resistance: 10K; Supplier: Farnell; Temperature Coefficient: ± 100PPM; Temperature Range: -55°C to +125°C; Voltage Rating: 50V
  R500: Order Code Supplier: 2130939
  R504: Order Code Supplier: 1469748
R501-R503 = 470/0603/0125W/50V: as R104 on sheet OpenMPPT2-Supply; Case Style: 0603; Order Code Supplier: 1576273; Power Rating: 0.125W; Price: 0,08; Resistance: 470R; Supplier: Farnell; Temperature Coefficient: ± 100PPM; Temperature Range: -55°C to +155°C; Voltage Rating: 50V
SW500 = TactSwitch: Tactile switch angled; Brand Number: FSMRA4JH; Supplier: Farnell; Case Style: Switch; Price: 0.215; Order Code Supplier: 1555988; Supplier 1: Farnell; Supplier Part Number 1: 1555988

## Sheet OpenMPPT2-CAN.SchDoc: =Project + Document
size A4; SheetNumber: 4; SheetTotal: SheetTotaal; Document: CAN
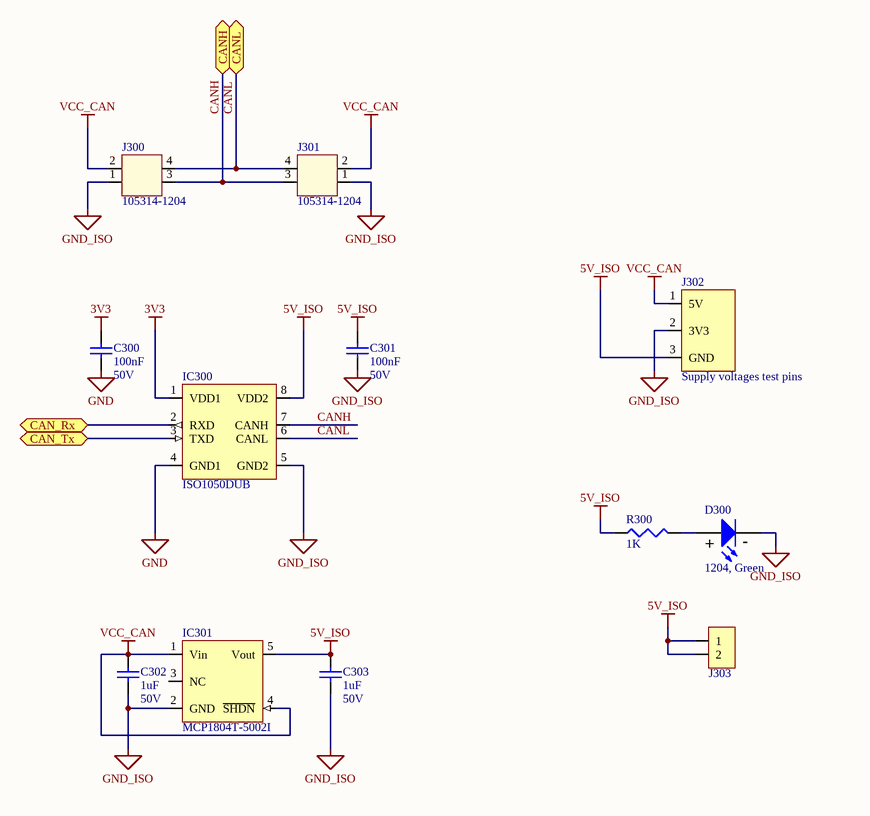
[diagram p5: OpenMPPT2-CAN.SchDoc]

### Parts
C300  100nF  Voltage Rating: 50V  [C0603]
C301  100nF  Voltage Rating: 50V  [C0603]
C302  1uF  Voltage Rating: 50V  [C-0805]
C303  1uF  Voltage Rating: 50V  [C-0805]
D300  1204, Green  [WL-SMSW, 1204]
IC300  ISO1050DUB  [DUB (P-DSO-G8)]
IC301  MCP1804T-5002I  [SOT-23-5]
J300  105314-1204  [Nano-Fit 4p RA]
J301  105314-1204  [Nano-Fit 4p RA]
J302  Supply voltages test pins  [Header 2.54 3p]
J303  2p male right angle header  [2P Angled Header Male, THT]  (value not drawn)
R300  1K  [0603]

### Ports
CAN_Rx, CAN_Tx, CANH, CANL

### Nets
3V3: C300.2 IC300.1(VDD1)
5V_ISO: C301.2 C303.1 IC300.8(VDD2) IC301.5(Vout) J302.3(GND) J303.1 J303.2 R300.1
GND: C300.1 IC300.4(GND1)
GND_ISO: C301.1 C302.2 C303.2 D300.1 IC300.5(GND2) IC301.2(GND) J300.1 J301.1 J302.2(3V3)
VCC_CAN: C302.1 IC301.1(Vin) IC301.4(~{SHDN}) J300.2 J301.2 J302.1(5V)
CANH: IC300.7(CANH) J300.3 J301.3 ; port CANH
CANL: IC300.6(CANL) J300.4 J301.4 ; port CANL
NetD300_2: D300.2 R300.2
NetIC300_2: IC300.2(RXD) ; port CAN_Rx
NetIC300_3: IC300.3(TXD) ; port CAN_Tx

Not connected (* = marked no-connect by the designer): IC301 3(NC)

### Notes on the sheet
- Title
- Size:
- Date:
- A4
- Designer:
- Time:
- Revision:
- Sheet
- of
- File:
- (in symbol 155124GS73200) +; -

### Library data of the parts
C300 C301 = 100nF/0603/CER/50V: as C200 on sheet OpenMPPT2-Control; Dielectric Characteristic: X7R; Capacitance: 100nF; Temperature Range: -55°C to +125°C; Price: 0,008; Order Code Supplier: 1759122RL; Supplier: Farnell
C302 C303 = 1uF/0805/CER/50V: Capacitor, 1uF, 50V,  X7R; Capacitance Tolerance: ± 10%; Capacitor Case Style: 0805; Brand Number: GRM21BR71H105KA12L; Brand: MURATA; Dielectric Characteristic: X7R; Capacitance: 1uF; Temperature Range: -55°C to +125°C; Price: 0,27; Order Code Supplier: 1735541; Supplier: Farnell
D300 = 155124GS73200: WL-SMSW SMD chip LED side view mono-color waterclear, size 1204, Green; PublishedDate: Oct. 2016; Publisher: Wurth Elektronik; ComponentLink1Description: Manufacturer; ComponentLink1URL: http://www.we-online.de; ComponentLink2Description: Datasheet; ComponentLink2URL: http://katalog.we-online.de/led/datasheet/155124GS73200.pdf; PartNumber: 155124GS73200; Size: 1204; Emitting Color: Green
IC300 = ISO1050DUB: CAN TRANSCEIVER; Brand: Texas Instruments; Case Style: SOIC8; Brand Number: ISO1050DUB; Order Code Supplier: 1755712; Price: 3,81; Supplier: Farnell; Temperature Range: -55°C to +155°C
IC301 = MCP1804T-5002I: LDO, Fixed, 5V, 150mA; Brand: Microchip; Brand Number: MCP1804T-5002I; Case Style: SOT-23-5; Order Code Supplier: 1825007; Price: 0,677; Supplier: Farnell; Temperature Range: -40°C to +85°C
J300 J301 = 105314-1204: Molex nano-fit 4 pins connector, dual row, right angle; Case Style: 105313; Pitch: 2.5mm; Brand: MOLEX; Brand Number: 105314-1204; Order Code Supplier: 538-105314-1204; Price: 1,16; Supplier: Mouser
J302 = Supply voltages test pins: Standard 2.54mm pins for 5V, 3V3, and GND
J303 = 2p male right angle header: 2p 2.54mm male right angle header; Brand: Samtec; Brand Number: TSW-107-08-G-D-RA; Pitch: 2,54mm; Order Code Supplier: 2032722; Price: 1,48; Supplier: Farnell
R300 = 1K/0603/0063W/50V: as R407 on sheet OpenMPPT2-Power-Stage; Case Style: 0603; Order Code Supplier: 2130855; Power Rating: 0.063W; Price: 0,039; Resistance: 1K; Supplier: Farnell; Temperature Coefficient: ± 100PPM; Temperature Range: -55°C to +125°C; Voltage Rating: 50V

## Nets that join several sheets
3V3: OpenMPPT2-Control (10 pins), OpenMPPT2-Supply (C107.1 L101.2 R102.1 R104.1), OpenMPPT2-DEBUG (5 pins), OpenMPPT2-CAN (C300.2 IC300.1)
5V_ISO: OpenMPPT2-DEBUG (C502.2 IC500.8), OpenMPPT2-CAN (8 pins)
12V: OpenMPPT2-Supply (7 pins), OpenMPPT2-Power-Stage (C403.2 D400.1 IC400.19 R401.2)
GND: OpenMPPT2-Control (10 pins), OpenMPPT2-Supply (12 pins), OpenMPPT2-Power-Stage (42 pins), OpenMPPT2-DEBUG (10 pins), OpenMPPT2-CAN (C300.1 IC300.4)
GND_ISO: OpenMPPT2-DEBUG (C502.1 IC500.5), OpenMPPT2-CAN (9 pins)
VBATT: OpenMPPT2-Supply (C101.2 C102.2 IC100.5), OpenMPPT2-Power-Stage (9 pins)
DEBUG_Rx: OpenMPPT2-Control (U200.30), OpenMPPT2-DEBUG (J502.1)
DEBUG_Tx: OpenMPPT2-Control (U200.29), OpenMPPT2-DEBUG (J502.2)
DIR: OpenMPPT2-Control (U200.19), OpenMPPT2-Power-Stage (IC400.44 R420.1)
ENABLE: OpenMPPT2-Control (U200.18), OpenMPPT2-Power-Stage (IC400.10 IC400.39)
~{FAULT}: OpenMPPT2-Control (U200.6), OpenMPPT2-Power-Stage (IC400.27)
I_Sense_Panel: OpenMPPT2-Control (U200.15), OpenMPPT2-Power-Stage (C419.2 IC400.37 R419.1)
NetC503_2: OpenMPPT2-Control (U200.25), OpenMPPT2-DEBUG (C503.2 R504.2 SW500.1)
NetIC300_2: OpenMPPT2-Control (U200.21), OpenMPPT2-CAN (IC300.2)
NetIC300_3: OpenMPPT2-Control (U200.22), OpenMPPT2-CAN (IC300.3)
NetIC500_2: OpenMPPT2-Control (U200.9), OpenMPPT2-DEBUG (IC500.2)
NetIC500_3: OpenMPPT2-Control (U200.8), OpenMPPT2-DEBUG (IC500.3)
NetR402_1: OpenMPPT2-Control (U200.20), OpenMPPT2-Power-Stage (R402.1)
NetR501_1: OpenMPPT2-Control (U200.28), OpenMPPT2-DEBUG (R501.1)
NetR502_1: OpenMPPT2-Control (U200.27), OpenMPPT2-DEBUG (R502.1)
NetR503_1: OpenMPPT2-Control (U200.26), OpenMPPT2-DEBUG (R503.1)
STM_~{RST}: OpenMPPT2-Control (U200.4), OpenMPPT2-DEBUG (J500.5)
SWCLK: OpenMPPT2-Control (U200.24), OpenMPPT2-DEBUG (C500.1 J500.2 R500.1)
SWDIO: OpenMPPT2-Control (U200.23), OpenMPPT2-DEBUG (J500.4)
V_Sense_Batt: OpenMPPT2-Control (U200.13), OpenMPPT2-Power-Stage (C414.1 R416.2 R418.1)
V_Sense_Panel: OpenMPPT2-Control (U200.14), OpenMPPT2-Power-Stage (C409.1 R406.2 R407.1)